# EAGLE design ST link V2 (EAGLE 6.1)
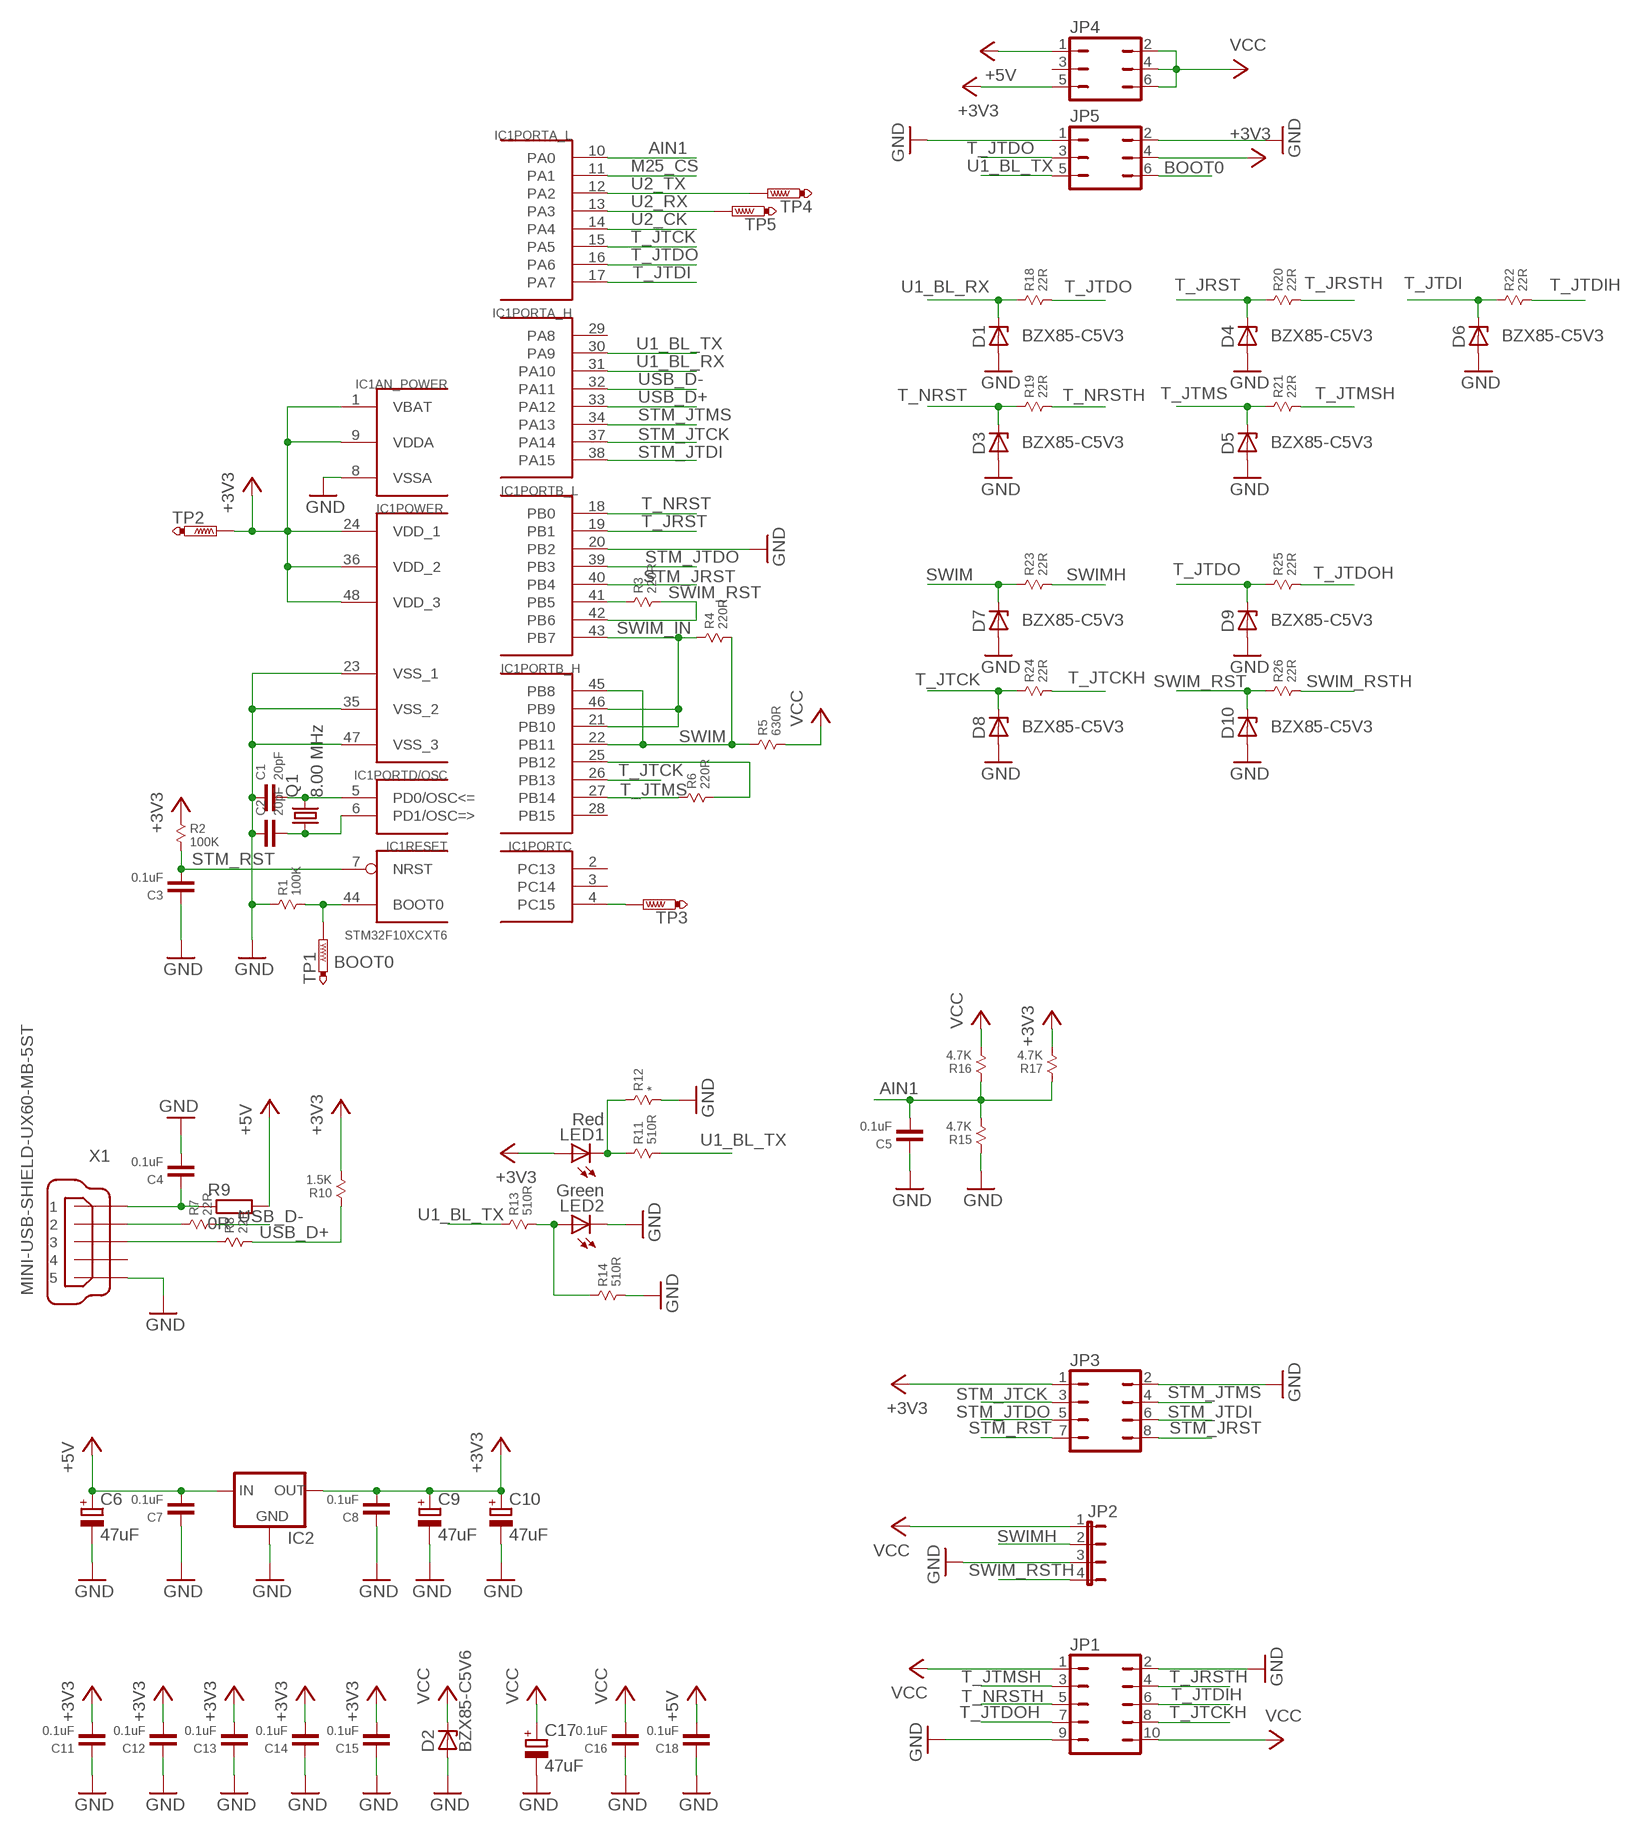
[diagram p0: schematic, sheet 1]

## Parts
C1  20pF  X893_CAP-0805  [X893_0805]
C2  20pF  X893_CAP-0805  [X893_0805]
C3  0.1uF  X893_CAP-0805  [X893_0805]
C4  0.1uF  X893_CAP-0805  [X893_0805]
C5  0.1uF  X893_CAP-0805  [X893_0805]
C6  47uF  CPOL-EUSMCB  [SMC_B]
C7  0.1uF  X893_CAP-0805  [X893_0805]
C8  0.1uF  X893_CAP-0805  [X893_0805]
C9  47uF  CPOL-EUSMCB  [SMC_B]
C10  47uF  CPOL-EUSMCB  [SMC_B]
C11  0.1uF  X893_CAP-0805  [X893_0805]
C12  0.1uF  X893_CAP-0805  [X893_0805]
C13  0.1uF  X893_CAP-0805  [X893_0805]
C14  0.1uF  X893_CAP-0805  [X893_0805]
C15  0.1uF  X893_CAP-0805  [X893_0805]
C16  0.1uF  X893_CAP-0805  [X893_0805]
C17  47uF  CPOL-EUSMCB  [SMC_B]
C18  0.1uF  X893_CAP-0805  [X893_0805]
D1  BZX85-C5V3  ZENER-DIODESOD80C  [SOD80C]
D2  BZX85-C5V6  ZENER-DIODESOD80C  [SOD80C]
D3  BZX85-C5V3  ZENER-DIODESOD80C  [SOD80C]
D4  BZX85-C5V3  ZENER-DIODESOD80C  [SOD80C]
D5  BZX85-C5V3  ZENER-DIODESOD80C  [SOD80C]
D6  BZX85-C5V3  ZENER-DIODESOD80C  [SOD80C]
D7  BZX85-C5V3  ZENER-DIODESOD80C  [SOD80C]
D8  BZX85-C5V3  ZENER-DIODESOD80C  [SOD80C]
D9  BZX85-C5V3  ZENER-DIODESOD80C  [SOD80C]
D10  BZX85-C5V3  ZENER-DIODESOD80C  [SOD80C]
IC1  STM32F10XCXT6  [TQFP48]
IC2  LM1117  [SOT223]
JP1  JP5Q  [JP5Q]
JP2  JP4E  [JP4]
JP3  JP4Q  [JP4Q]
JP4  JP3Q  [JP3Q]
JP5  JP3Q  [JP3Q]
LED1  Red  LEDSML0805  [SML0805]
LED2  Green  LEDSML0805  [SML0805]
Q1  8.00 MHz  CRYSTALHC49U70  [HC49U70]
R1  100K  X893_RESISTOR-0805  [X893_0805]
R2  100K  X893_RESISTOR-0805  [X893_0805]
R3  220R  X893_RESISTOR-0805  [X893_0805]
R4  220R  X893_RESISTOR-0805  [X893_0805]
R5  630R  X893_RESISTOR-0805  [X893_0805]
R6  220R  X893_RESISTOR-0805  [X893_0805]
R7  22R  X893_RESISTOR-0805  [X893_0805]
R8  22R  X893_RESISTOR-0805  [X893_0805]
R9  0R  R-EU_R1206  [R1206]
R10  1.5K  X893_RESISTOR-0805  [X893_0805]
R11  510R  X893_RESISTOR-0805  [X893_0805]
R12  *  X893_RESISTOR-0805  [X893_0805]
R13  510R  X893_RESISTOR-0805  [X893_0805]
R14  510R  X893_RESISTOR-0805  [X893_0805]
R15  4.7K  X893_RESISTOR-0805  [X893_0805]
R16  4.7K  X893_RESISTOR-0805  [X893_0805]
R17  4.7K  X893_RESISTOR-0805  [X893_0805]
R18  22R  X893_RESISTOR-0805  [X893_0805]
R19  22R  X893_RESISTOR-0805  [X893_0805]
R20  22R  X893_RESISTOR-0805  [X893_0805]
R21  22R  X893_RESISTOR-0805  [X893_0805]
R22  22R  X893_RESISTOR-0805  [X893_0805]
R23  22R  X893_RESISTOR-0805  [X893_0805]
R24  22R  X893_RESISTOR-0805  [X893_0805]
R25  22R  X893_RESISTOR-0805  [X893_0805]
R26  22R  X893_RESISTOR-0805  [X893_0805]
TP1  PTR1TP19R  [TP19R]
TP2  PTR1TP19R  [TP19R]
TP3  PTR1TP19R  [TP19R]
TP4  PTR1TP19R  [TP19R]
TP5  PTR1TP19R  [TP19R]
X1  MINI-USB-SHIELD-UX60-MB-5ST  [UX60-MB-5ST]

## Nets
+3V3: C8.1 C9.+ C10.+ C11.1 C12.1 C13.1 C14.1 C15.1 IC1.1(AN_POWER:VBAT) IC1.9(AN_POWER:VDDA) IC1.24(POWER:VDD_1) IC1.36(POWER:VDD_2) IC1.48(POWER:VDD_3) IC2.2(OUT) JP3.1 JP4.5 JP5.4 LED1.A R2.1 R10.2 R17.2 TP2.TP
+5V: C6.+ C7.1 C18.1 IC2.3(IN) JP4.1 R9.2
AIN1: C5.1 IC1.10(PORTA_L:PA0) R15.2 R16.1 R17.1
BOOT0: IC1.44(RESET:BOOT0) JP5.6 R1.2 TP1.TP
GND: C1.2 C2.2 C3.2 C4.1 C5.2 C6.- C7.2 C8.2 C9.- C10.- C11.2 C12.2 C13.2 C14.2 C15.2 C16.2 C17.- C18.2 D1.A D2.A D3.A D4.A D5.A D6.A D7.A D8.A D9.A D10.A IC1.8(AN_POWER:VSSA) IC1.20(PORTB_L:PB2) IC1.23(POWER:VSS_1) IC1.35(POWER:VSS_2) IC1.47(POWER:VSS_3) IC2.1(GND) JP1.2 JP1.9 JP2.3 JP3.2 JP5.1 JP5.2 LED2.C R1.1 R12.2 R14.2 R15.1 X1.5
M25_CS: IC1.11(PORTA_L:PA1)
N$1: C1.1 IC1.5(PORTD/OSC:PD0/OSC<=) Q1.2
N$2: C2.1 IC1.6(PORTD/OSC:PD1/OSC=>) Q1.1
N$3: IC1.4(PORTC:PC15) TP3.TP
N$4: C4.2 R9.1 X1.1
N$5: IC1.25(PORTB_H:PB12) R6.2
N$6: R7.1 X1.2
N$7: R8.1 X1.3
N$8: LED1.C R11.1 R12.1
N$9: IC1.41(PORTB_L:PB5) R3.1
N$10: LED2.A R13.2 R14.1
STM_JRST: IC1.40(PORTB_L:PB4) JP3.8
STM_JTCK: IC1.37(PORTA_H:PA14) JP3.3
STM_JTDI: IC1.38(PORTA_H:PA15) JP3.6
STM_JTDO: IC1.39(PORTB_L:PB3) JP3.5
STM_JTMS: IC1.34(PORTA_H:PA13) JP3.4
STM_RST: C3.1 IC1.7(RESET:NRST) JP3.7 R2.2
SWIM: D7.C IC1.22(PORTB_H:PB11) IC1.45(PORTB_H:PB8) R4.2 R5.1 R23.1
SWIM_IN: IC1.21(PORTB_H:PB10) IC1.43(PORTB_L:PB7) IC1.46(PORTB_H:PB9) R4.1
SWIM_RST: D10.C IC1.42(PORTB_L:PB6) R3.2 R26.1
SWIM_RSTH: JP2.4 R26.2
SWIMH: JP2.2 R23.2
T_JRST: D4.C IC1.19(PORTB_L:PB1) R20.1
T_JRSTH: JP1.4 R20.2
T_JTCK: D8.C IC1.15(PORTA_L:PA5) IC1.26(PORTB_H:PB13) R24.1
T_JTCKH: JP1.8 R24.2
T_JTDI: D6.C IC1.17(PORTA_L:PA7) R22.1
T_JTDIH: JP1.6 R22.2
T_JTDO: D9.C IC1.16(PORTA_L:PA6) JP5.3 R18.2 R25.1
T_JTDOH: JP1.7 R25.2
T_JTMS: D5.C IC1.27(PORTB_H:PB14) R6.1 R21.1
T_JTMSH: JP1.3 R21.2
T_NRST: D3.C IC1.18(PORTB_L:PB0) R19.1
T_NRSTH: JP1.5 R19.2
U1_BL_RX: D1.C IC1.31(PORTA_H:PA10) R18.1
U1_BL_TX: IC1.30(PORTA_H:PA9) JP5.5 R11.2 R13.1
U2_CK: IC1.14(PORTA_L:PA4)
U2_RX: IC1.13(PORTA_L:PA3) TP5.TP
U2_TX: IC1.12(PORTA_L:PA2) TP4.TP
USB_D+: IC1.33(PORTA_H:PA12) R8.2 R10.1
USB_D-: IC1.32(PORTA_H:PA11) R7.2
VCC: C16.1 C17.+ D2.C JP1.1 JP1.10 JP2.1 JP4.2 JP4.4 JP4.6 R5.2 R16.2
Unconnected: IC1.2(PORTC:PC13) IC1.3(PORTC:PC14) IC1.28(PORTB_H:PB15) IC1.29(PORTA_H:PA8) JP4.3 X1.4 X1.M1(S1) X1.M2(S2) X1.M3(S3) X1.M4(S4)

## Library data of the parts
C1-C5 C7 C8 C11-C16 C18 = maple-10x-20x:X893_CAP: Capacitor
C6 C9 C10 C17 = resistor:CPOL-EU: POLARIZED CAPACITOR, European symbol
D1-D10 = diode:ZENER-DIODE: Z-Diode
IC1 = stm32:STM32F10XCXT6: ST STM32F101/103 48pin LQFP
IC2 = v-reg-3:LM1117
JP1 = jumper:JP5Q: JUMPER
JP2 = jumper:JP4E: JUMPER
JP3 = jumper:JP4Q: JUMPER
JP4 JP5 = jumper:JP3Q: JUMPER
LED1 LED2 = led:LED: LED OSRAM: - CHIPLED LG R971, LG N971, LY N971, LG Q971, LY Q971, LO R971, LY R971 LH N974, LH R974 LS Q976, LO Q976, LY Q976 LO Q996 - Hyper CHIPLED LW Q18S LB Q993, LB Q99A, LB R99A - SideLED LS A670, LO A670, LY A670, LG A670, LP A670 LB A673, LV A673, LT A673, LW A673 LH A674 LY A675 LS A676, LA A676, LO A676, LY A676, LW A676 LS A679, LY A679, LG A679 - Hyper Micro SIDELED® LS Y876, LA Y876, LO Y876, LY Y876 LT Y87S - SmartLED LW L88C, LW L88S LB L89C, LB L89S, LG L890 LS L89K, LO L89K, LY L89K LS L896, LA L896, LO L896, LY L896 - TOPLED LS T670, LO T670, LY T670, LG T670, LP T670 LSG T670, LSP T670, LSY T670, LOP T670, LYG T670 LG T671, LOG T671, LSG T671 LB T673, LV T673, LT T673, LW T673 LH T674 LS T676, LA T676, LO T676, LY T676, LB T676, LH T676, LSB T676, LW T676 LB T67C, LV T67C, LT T67C, LS T67K, LO T67K, LY T67K, LW E67C LS E67B, LA E67B, LO E67B, LY E67B, LB E67C, LV E67C, LT E67C LW T67C LS T679, LY T679, LG T679 LS T770, LO T770, LY T770, LG T770, LP T770 LB T773, LV T773, LT T773, LW T773 LH T774 LS E675, LA E675, LY E675, LS T675 LS T776, LA T776, LO T776, LY T776, LB T776 LHGB T686 LT T68C, LB T68C - Hyper Mini TOPLED® LB M676 - Mini TOPLED Santana® LG M470 LS M47K, LO M47K, LY M47K Source: http://www.osram.convergy.de LUXEON: - LUMILED® LXK2-PW12-R00, LXK2-PW12-S00, LXK2-PW14-U00, LXK2-PW14-V00 LXK2-PM12-R00, LXK2-PM12-S00, LXK2-PM14-U00 LXK2-PE12-Q00, LXK2-PE12-R00, LXK2-PE12-S00, LXK2-PE14-T00, LXK2-PE14-U00 LXK2-PB12-K00, LXK2-PB12-L00, LXK2-PB12-M00, LXK2-PB14-N00, LXK2-PB14-P00, LXK2-PB14-Q00 LXK2-PR12-L00, LXK2-PR12-M00, LXK2-PR14-Q00, LXK2-PR14-R00 LXK2-PD12-Q00, LXK2-PD12-R00, LXK2-PD12-S00 LXK2-PH12-R00, LXK2-PH12-S00 LXK2-PL12-P00, LXK2-PL12-Q00, LXK2-PL12-R00 Source: www.luxeon.com KINGBRIGHT: KA-3528ASYC Source: www.kingbright.com
Q1 = crystal:CRYSTAL: CRYSTAL; OC_FARNELL: unknown; OC_NEWARK: unknown
R1-R8 R10-R26 = maple-10x-20x:X893_RESISTOR
R9 = rcl:R-EU_: RESISTOR, European symbol
TP1-TP5 = testpad:PTR1: TEST PIN
X1 = con-hirose:MINI-USB-SHIELD-: MINI USB Connector Source: http://www.hirose.co.jp/cataloge_hp/e24000019.pdf; OC_FARNELL: unknown; OC_NEWARK: unknown

## Board
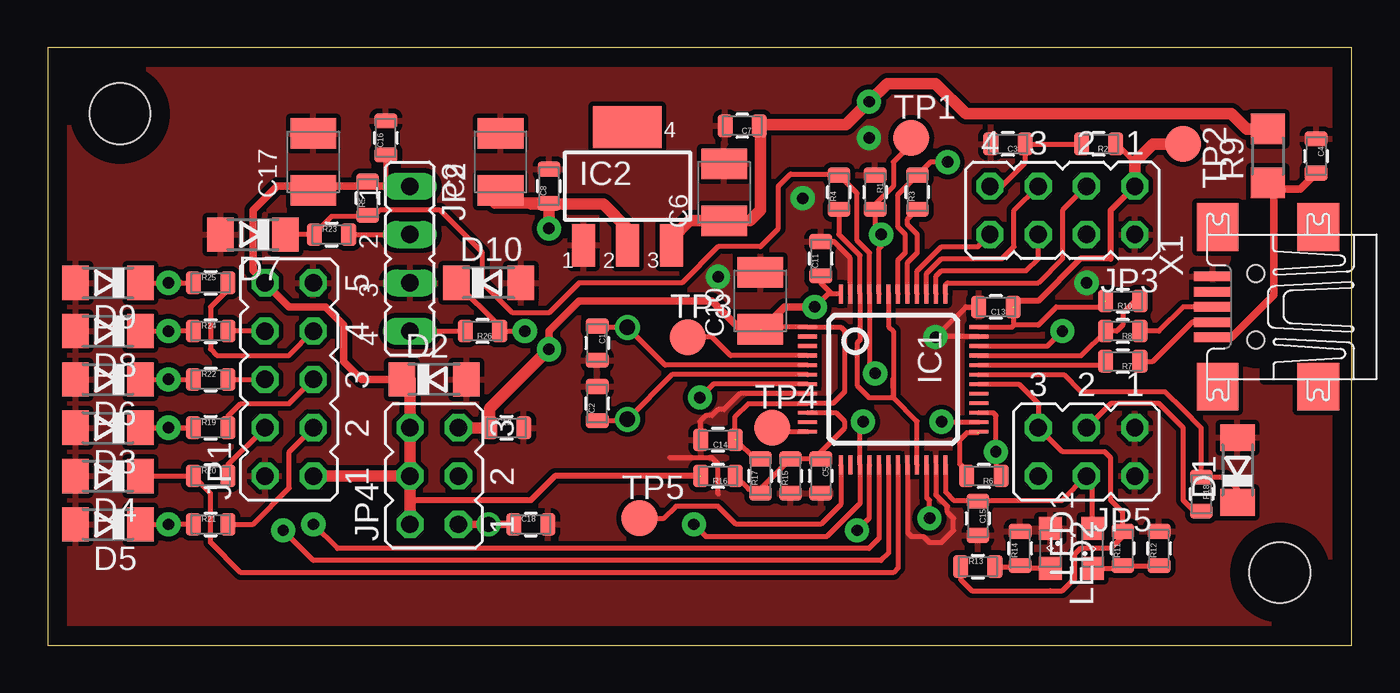
[diagram p1: board, top side]
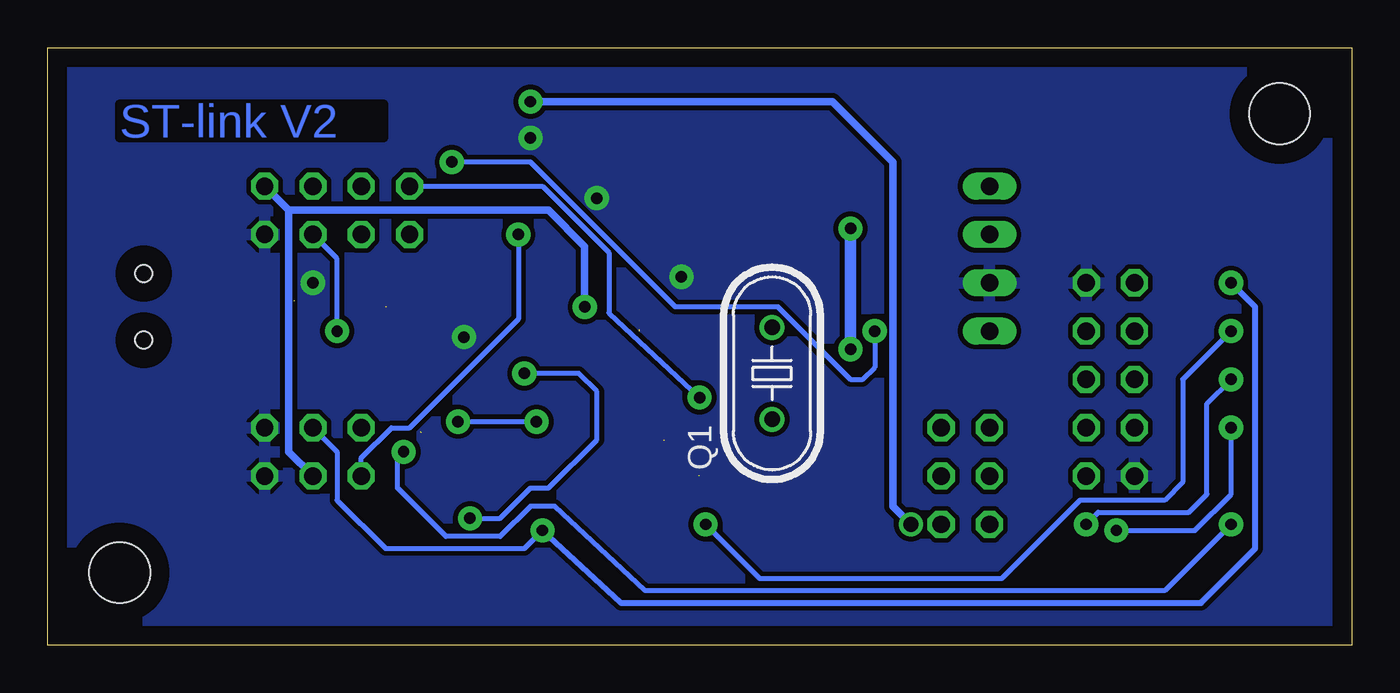
[diagram p2: board, bottom side, seen from below]

Size 68.56 x 31.42 mm. Coordinates in mm from the lower left corner, seen from the top.
Outline: 0,0 68.56,0 68.56,31.42 0,31.42 0,0
Copper layers (1*16): Top 0.035mm / dielectric 1.5mm / Bottom 0.035mm
Design rules: minimum track width 10mil, minimum drill 24mil, track to track 8mil, track to pad 8mil, pad to pad 8mil, via to via 8mil, smd to smd 8mil, copper to edge 40mil, drill to drill 8mil, minimum pad ring 10mil, minimum via ring 8mil, stop-mask expansion 4mil, vias tented up to drill 0mil, thermal gap 10mil
Holes 3.2 mm at 3.81,27.94 64.77,3.81

### Footprints (pad centres in the part's own frame; a part is rotated, then mirrored left to right if it is on the bottom)
X893_0805 = smd 0.8 x 1.2: 1 -0.9,0; 2 0.9,0
SMC_B = smd 1.6 x 2.4: + -1.5,0; - 1.5,0
SOD80C = smd 1.4 x 1.8: A 1.7,0; C -1.7,0
TQFP48 = smd 0.2 x 1: 1 -2.75,-4.5; 2 -2.25,-4.5; 3 -1.75,-4.5; 4 -1.25,-4.5; 5 -0.75,-4.5; 6 -0.25,-4.5; 7 0.25,-4.5; 8 0.75,-4.5; 9 1.25,-4.5; 10 1.75,-4.5; 11 2.25,-4.5; 12 2.75,-4.5; 25 2.75,4.5; 26 2.25,4.5; 27 1.75,4.5; 28 1.25,4.5; 29 0.75,4.5; 30 0.25,4.5; 31 -0.25,4.5; 32 -0.75,4.5; 33 -1.25,4.5; 34 -1.75,4.5; 35 -2.25,4.5; 36 -2.75,4.5 | smd 1 x 0.2: 13 4.5,-2.75; 14 4.5,-2.25; 15 4.5,-1.75; 16 4.5,-1.25; 17 4.5,-0.75; 18 4.5,-0.25; 19 4.5,0.25; 20 4.5,0.75; 21 4.5,1.25; 22 4.5,1.75; 23 4.5,2.25; 24 4.5,2.75; 37 -4.5,2.75; 38 -4.5,2.25; 39 -4.5,1.75; 40 -4.5,1.25; 41 -4.5,0.75; 42 -4.5,0.25; 43 -4.5,-0.25; 44 -4.5,-0.75; 45 -4.5,-1.25; 46 -4.5,-1.75; 47 -4.5,-2.25; 48 -4.5,-2.75
SOT223 = smd 1.219 x 2.235: 1 -2.311,-3.099; 2 0,-3.099; 3 2.311,-3.099 | smd 3.6 x 2.2: 4 0,3.099
JP5Q = drill 0.914 octagon: 1 -5.08,-1.27; 2 -5.08,1.27; 3 -2.54,-1.27; 4 -2.54,1.27; 5 0,-1.27; 6 0,1.27; 7 2.54,-1.27; 8 2.54,1.27; 9 5.08,-1.27; 10 5.08,1.27
JP4 = drill 0.914 long: 1 -3.81,0; 2 -1.27,0; 3 1.27,0; 4 3.81,0
JP4Q = drill 0.914 octagon: 1 -3.81,-1.27; 2 -3.81,1.27; 3 -1.27,-1.27; 4 -1.27,1.27; 5 1.27,-1.27; 6 1.27,1.27; 7 3.81,-1.27; 8 3.81,1.27
JP3Q = drill 0.914 octagon: 1 -2.54,-1.27; 2 -2.54,1.27; 3 0,-1.27; 4 0,1.27; 5 2.54,-1.27; 6 2.54,1.27
SML0805 = smd 1.2 x 1.2: A 1.05,0; C -1.05,0
HC49U70 = drill 0.813: 1 -2.413,0; 2 2.413,0
R1206 = smd 1.6 x 1.803: 1 -1.422,0; 2 1.422,0
TP19R = smd 1.9 x 1.9: TP 0,0
UX60-MB-5ST = smd 2 x 0.5: 1 2.25,1.6; 2 2.25,0.8; 3 2.25,0; 4 2.25,-0.8; 5 2.25,-1.6 | smd 2.2 x 2.5: M1 -3.3,-4.2; M2 -3.3,4.2; M3 2,4.2; M4 2,-4.2 | hole 0.9: 0,-1.75; 0,1.75

### Placement (x,y rotation side)
C1  28.89,15.88 270 top
C2  28.89,12.7 90 top
C3  50.48,26.35 180 top
C4  66.67,25.72 270 top
C5  40.64,8.89 270 top
C6  35.56,23.81 90 top
C7  36.51,27.3 180 top
C8  26.35,24.13 90 top
C9  23.81,25.4 90 top
C10  37.47,18.1 90 top
C11  40.64,20.32 90 top
C12  24.13,11.43 0 top
C13  49.85,17.78 180 top
C14  35.24,10.79 180 top
C15  48.9,6.67 270 top
C16  17.78,26.67 90 top
C17  13.97,25.4 90 top
C18  25.4,6.35 0 top
D1  62.55,9.21 90 top
D2  20.32,13.97 0 top
D3  3.17,11.43 180 top
D4  3.17,8.89 180 top
D5  3.17,6.35 180 top
D6  3.17,13.97 180 top
D7  10.79,21.59 180 top
D8  3.17,16.51 180 top
D9  3.17,19.05 180 top
D10  23.18,19.05 0 top
IC1  44.45,13.97 270 top
IC2  30.48,24.13 0 top
JP1  12.7,13.97 90 top
JP2  19.05,20.32 270 top
JP3  53.34,22.86 180 top
JP4  20.32,8.89 90 top
JP5  54.61,10.16 180 top
LED1  54.93,5.08 90 top
LED2  52.7,5.08 270 top
Q1  30.48,14.29 90 bottom
R1  43.5,23.81 270 top
R2  55.24,26.35 180 top
R3  45.72,23.81 90 top
R4  41.59,23.81 90 top
R5  16.83,23.5 90 top
R6  49.21,8.89 180 top
R7  56.52,14.92 180 top
R8  56.52,16.51 180 top
R9  64.14,25.72 90 top
R10  56.52,18.1 180 top
R11  56.52,5.08 90 top
R12  58.42,5.08 90 top
R13  48.9,4.13 0 top
R14  51.12,5.08 90 top
R15  39.05,8.89 90 top
R16  35.24,8.89 180 top
R17  37.47,8.89 90 top
R18  60.64,7.94 270 top
R19  8.57,11.43 0 top
R20  8.57,8.89 0 top
R21  8.57,6.35 0 top
R22  8.57,13.97 0 top
R23  14.92,21.59 0 top
R24  8.57,16.51 0 top
R25  8.57,19.05 0 top
R26  22.86,16.51 180 top
TP1  45.4,26.67 0 top
TP2  59.69,26.35 270 top
TP3  33.66,16.19 0 top
TP4  38.1,11.43 0 top
TP5  31.11,6.67 0 top
X1  63.5,17.78 180 top

### Tracks (layer width: path | path; a pad name or v marks a point on that pad's centre or on a via)
+3V3  (via drill 0.6 pad 1.27)  (4 unrouted)
  Top 0.254: LED1.A 54.93,8.57 JP5.4 53.34,7.62 48.95,7.62 | IC1.48 41.22,18.47 | 41.22,18.47 40.64,19.05 C11.1 | 41.22,18.47 41.01,18.47 v40.32,17.78 | IC1.24 47.2,8.04 47.62,7.62 48.95,7.62 | 48.95,7.62 C15.1 | 36.2,10.79 37.2,9.79 R17.2 | C14.1 36.14,12.01 36.83,12.7 39.93,12.7 IC1.9 41.3,12.72 41.91,13.34 41.91,16.51 41.7,16.72 IC1.1 37.04,16.72 36.92,16.6 | C10.+ 36.92,16.6 | 36.92,16.6 36.83,16.51 | R2.1 56.2,26.35 57.15,25.4 | IC1.36 50.69,16.72 50.8,16.83 | 50.8,16.83 50.8,17.78 | 50.8,16.83 52.07,16.83 53.02,17.78 55.24,17.78 55.56,18.1
  Top 0.305: JP3.1 55.88,22.86 55.88,20.32 54.29,20.32 52.07,18.1 51.12,18.1 50.8,17.78
  Top 0.406: C10.+ 36.42,16.6 34.92,18.1 27.94,18.1 26.35,16.51 v26.35,15.56 | v40.32,17.78 38.73,17.78 37.47,16.51
  Top 0.61: JP3.1 57.15,25.4 58.1,26.35 TP2.TP | 26.35,23.18 25.45,23.18 C8.1 23.53,23.23 C9.+ | IC2.2 30.48,21.91 29.21,23.18 26.35,23.18 | 26.35,23.18 v26.35,21.91 | JP4.5 C12.1 23.23,12.44 v26.35,15.56
  Bottom 0.406: v40.32,17.78 40.32,20.95 42.23,22.86 55.88,22.86 | 55.88,22.86 JP3.1 | JP5.4 55.88,10.16 55.88,22.86
  Bottom 0.61: v26.35,21.91 v26.35,15.56
+5V  (via drill 0.6 pad 1.27, 0.8 pad 1.27)
  Top 0.406: JP4.1 v23.18,6.35 C18.1
  Top 0.61: R9.2 63.03,27.14 62.23,27.94 48.26,27.94 46.67,29.53 44.13,29.53 v43.18,28.57 41.96,27.36 37.47,27.36 C7.1 37.47,27.25 37.47,22.86 36.92,22.31 C6.+ 33.74,22.31 32.79,21.36 IC2.3
  Bottom 0.406: v43.18,28.57 27.3,28.57 24.13,25.4 24.13,7.3 v23.18,6.35
AIN1
  Top 0.254: IC1.10 41.44,12.22 41.59,12.06 41.91,11.75 41.91,11.43 40.64,10.16 C5.1 39.32,9.79 39.05,9.53 R15.2 37.47,8.2 | 37.47,8.2 R17.1 37.47,8.2 | 37.47,8.2 36.83,8.2 R16.1
BOOT0  (via drill 0.6 pad 1.27)
  Top 0.254: IC1.44 43.7,20.84 43.81,20.95 v43.81,21.59 43.5,21.91 R1.2 43.5,23.18 44.45,24.13 44.45,25.4 45.4,26.35 TP1.TP
  Bottom 0.254: JP5.6 52.07,9.84 50.48,11.43 49.53,11.43 43.81,17.14 v43.81,21.59
GND  (via drill 0.6 pad 1.27)
  Top 0.254: IC1.47 42.2,20.35 41.33,21.22 C11.2 | 35.24,7.94 35.24,9.53 34.92,9.84 32.7,9.84 | IC1.35 47.28,16.22 46.99,16.51 48.26,17.78 C13.2 | IC1.20 45.2,5.92 45.4,5.71 46.04,5.71 46.35,5.4 46.99,5.4 47.62,6.03 47.62,6.67 47.31,6.99 47.31,7.3 46.67,7.94 46.7,7.96 IC1.23 | IC1.8 36.4,13.22 35.56,12.38 35.24,12.38 34.92,12.06 34.61,12.06 34.29,11.75 34.29,10.85 C14.2
  other vias: 35.24,19.37 43.18,26.67 39.69,23.5 54.61,19.05 46.67,16.19
  pour Top (isolate 0.254): 74.93,-10.16 74.93,43.18 -8.89,43.18 -8.89,-5.08 -8.89,-10.16
  pour Bottom (isolate 0.254): -5.08,45.72 -5.08,-6.35 72.39,-6.35 72.39,45.72
N$1
  Top 0.254: IC1.5 32.46,14.72 Q1.2 28.97,16.7 C1.1
N$2
  Top 0.254: IC1.6 32.83,14.22 Q1.1 30.41,11.8 C2.1
N$3
  Top 0.254: IC1.4 35.9,15.22 34.92,16.19 TP3.TP
N$4
  Top 0.406: X1.1 62.22,16.18 62.87,16.83 64.45,18.41 64.45,23.98 | 64.45,23.98 R9.1 | 64.45,23.98 65.83,23.98 C4.2
N$5  (1 unrouted)
  Top 0.254: 48.9,11.16 48.31,11.16 48.26,11.11 47.94,10.79 47.94,10.48 47.94,9.53 48.26,9.21 R6.2
N$6
  Top 0.254: X1.2 60.16,16.98 58.42,15.24 58.1,14.92 R7.1
N$7
  Top 0.254: X1.3 59.69,17.78 58.42,16.51 R8.1 | R8.1 57.15,16.51 R8.1
N$8
  Top 0.254: 55.3,3.66 LED1.C 56.37,4.03 R11.1 R12.1
N$9
  Top 0.254: R3.1 45.2,22.39 45.2,22.11 45.72,21.59 45.72,20.64 45.4,20.32 45.2,20.12 IC1.41
N$10
  Top 0.254: 52.44,3.77 LED2.A 51.27,4.03 R14.1 51.06,4.13 R13.2
STM_JRST
  Top 0.254: IC1.40 45.7,19.66 46.99,20.95 48.9,20.95 JP3.8
STM_JTCK
  Top 0.254: JP3.3 53.34,22.86 53.34,20.32 52.07,19.05 47.31,19.05 47.2,18.94 IC1.37
STM_JTDI
  Top 0.254: IC1.38 46.7,19.39 46.99,19.68 51.44,19.68 52.07,20.32 JP3.6
STM_JTDO
  Top 0.254: IC1.39 46.2,19.53 46.99,20.32 50.16,20.32 50.8,20.95 50.8,22.86 JP3.5
STM_JTMS  (via drill 0.6 pad 1.27)
  Top 0.254: IC1.34 52.55,15.72 v53.34,16.51
  Bottom 0.254: v53.34,16.51 53.34,20.32 JP3.4
STM_RST  (via drill 0.6 pad 1.27)
  Top 0.254: IC1.7 34.99,13.72 v34.29,13.02 | R2.2 C3.1 51.38,25.35 50.16,24.13 JP3.7
  Bottom 0.254: JP3.7 42.55,24.13 39.05,20.64 39.05,17.46 v34.29,13.02
SWIM  (via drill 0.6 pad 1.27)
  Top 0.254: R4.2 42.55,23.76 42.55,21.27 43.2,20.62 IC1.45 43.2,14.59 v43.5,14.29 | v46.35,6.67 46.35,7.62 46.2,7.78 46.2,8.1 IC1.22 | 13.97,21.59 R23.1 14.02,21.64 | 13.97,21.59 D7.C | R4.2 41.22,24.71 | 16.88,22.54 14.92,22.54 13.97,21.59 | 16.88,22.54 17.14,22.54 17.46,22.86 20.64,22.86 22.86,20.64 22.86,19.05 24.45,17.46 26.35,17.46 27.94,19.05 33.34,19.05 35.24,20.95 37.47,20.95 38.42,21.91 38.42,24.13 39.05,24.77 41.54,24.77 R4.2 | 16.88,22.54 R5.1
  Bottom 0.254: v46.35,6.67 44.77,6.67 43.18,8.26 42.23,8.26 39.69,10.79 39.69,13.34 40.64,14.29 v43.5,14.29
SWIM_IN
  Top 0.254: R4.1 41.59,21.59 42.7,20.48 IC1.46 42.7,16.03 42.55,15.88 42.55,13.65 43.18,13.02 44.45,13.02 | 44.45,13.02 44.43,13.99 | IC1.43 44.2,16.76 44.45,16.51 44.45,13.02 | IC1.21 45.7,11.77 44.45,13.02
SWIM_RST  (via drill 0.6 pad 1.27)
  Top 0.254: D10.C 23.76,16.77 R26.1 v25.08,16.51 | v47.31,25.4 46.41,25.4 R3.2 44.7,23.69 44.7,21.98 45.09,21.59 45.09,20.64 44.7,20.25 IC1.42
  Bottom 0.254: v47.31,25.4 43.18,25.4 35.56,17.78 30.16,17.78 26.35,13.97 25.72,13.97 25.08,14.61 v25.08,16.51
SWIM_RSTH
  Top 0.254: JP2.4 R26.2
SWIMH
  Top 0.254: R23.2 JP2.2
T_JRST
  Top 0.254: D4.C R20.1 8.57,7.99 8.57,5.4 10.16,3.81 44.45,3.81 44.7,4.06 IC1.19
T_JRSTH
  Top 0.254: R20.2 9.47,9.47 JP1.4
T_JTCK  (via drill 0.6 pad 1.27)
  Top 0.254: IC1.26 47.02,11.72 v46.99,11.75 | D8.C v6.35,16.51 R24.1 | v33.97,6.35 34.61,5.71 40.96,5.71 42.7,7.46 IC1.15 42.7,11.59 v42.86,11.75
  Bottom 0.254: v46.99,11.75 v42.86,11.75 | v6.35,16.51 8.89,13.97 8.89,8.57 9.84,7.62 14.29,7.62 18.41,3.49 31.11,3.49 v33.97,6.35
T_JTCKH
  Top 0.254: JP1.8 R24.2
T_JTDI  (via drill 0.6 pad 1.27)
  Top 0.254: D6.C v6.35,13.97 | v6.35,13.97 7.62,13.97 | 7.62,13.97 R22.1 | IC1.17 43.7,5.6 43.18,5.08 15.24,5.08 v13.97,6.35 | v6.35,13.97 7.62,13.97
  Bottom 0.254: v13.97,6.35 13.34,6.99 8.57,6.99 7.62,7.94 7.62,12.7 v6.35,13.97
T_JTDIH
  Top 0.254: R22.2 JP1.6
T_JTDO  (via drill 0.6 pad 1.27)
  Top 0.254: 54.88,11.7 JP5.3 55.88,12.7 58.42,12.7 59.69,11.43 59.69,7.62 60.27,7.04 R18.2 | IC1.16 43.18,9.45 43.18,6.67 v42.55,6.03 | D9.C v6.35,19.05 | 6.99,19.05 R25.1
  Top 0.305: v6.35,19.05 6.99,19.05
  Bottom 0.254: JP5.3 53.34,10.16 53.34,7.62 50.8,5.08 43.5,5.08 v42.55,6.03
  Bottom 0.305: v6.35,19.05 5.08,17.78 5.08,5.08 7.94,2.22 38.42,2.22 v42.55,6.03
T_JTDOH
  Top 0.254: R25.2 9.47,18.68 8.57,17.78 8.57,15.56 8.89,15.24 12.7,15.24 JP1.7
T_JTMS  (via drill 0.6 pad 1.27)
  Top 0.254: IC1.27 49.69,12.22 49.85,12.06 v49.85,10.16 49.85,9.47 R6.1 | D5.C v6.35,6.35 R21.1
  Bottom 0.254: v6.35,6.35 9.84,2.86 37.15,2.86 41.91,7.3 43.18,7.3 44.77,5.71 47.62,5.71 50.16,8.26 50.16,9.84 v49.85,10.16
T_JTMSH
  Top 0.254: R21.2 10.79,6.35 12.7,8.26 12.7,10.16 JP1.3
T_NRST  (via drill 0.6 pad 1.27)
  Top 0.254: D3.C 5.08,11.43 | 5.08,11.43 v6.35,11.43 | v6.35,11.43 R19.1 v6.35,11.43 | v6.35,11.43 5.08,11.43 | IC1.18 44.2,4.83 43.81,4.45 13.97,4.45 v12.38,6.03 | v6.35,11.43 5.08,11.43
  Bottom 0.254: v12.38,6.03 11.75,6.03 8.26,6.03 6.35,7.94 v6.35,11.43
T_NRSTH
  Top 0.254: R19.2 9.47,12.01 10.16,12.7 12.7,12.7 JP1.5
U1_BL_RX
  Top 0.254: IC1.31 52.45,14.22 53.41,14.22 54.29,13.34 57.41,13.34 58.74,13.34 59.69,12.38 60.64,11.43 R18.1 61.91,8.84 62.55,8.2 D1.C
U1_BL_TX
  Top 0.254: IC1.30 51.05,13.72 52.07,12.7 JP5.5 53.34,10.16 55.56,10.16 55.88,9.84 55.88,7.62 56.52,6.99 R11.2 56.52,5.71 55.88,5.08 54.29,5.08 53.98,4.76 53.98,3.49 53.34,2.86 52.7,2.86 48.58,2.86 47.99,3.44 R13.1
U2_RX
  Top 0.254: IC1.13 41.7,7.41 40.64,6.35 36.2,6.35 35.24,7.3 33.02,7.3 32.38,6.67 TP5.TP
U2_TX
  Top 0.254: IC1.12 38.31,11.22 TP4.TP
USB_D+
  Top 0.254: IC1.33 54.33,15.22 R8.2 56.2,16.51 56.52,16.83 56.52,17.46 57.15,18.1 R10.1
USB_D-
  Top 0.254: IC1.32 55.41,14.72 R7.2
VCC  (1 unrouted)
  Top 0.254: 20.32,24.13 JP2.1 | C16.1 17.78,24.13 17.09,24.13 R5.2 | C17.+ 12.93,23.9 12.7,24.13
  Top 0.305: 34.29,8.89 26.67,8.89 25.4,7.62 19.05,7.62
  Top 0.406: JP2.1 17.78,24.13 12.7,24.13 12.06,24.13 10.79,22.86 10.79,19.68 JP1.10 12.7,17.78 14.61,17.78 15.56,16.83 15.56,14.92 16.51,13.97 18.73,13.97
  Top 0.61: JP4.2 19.05,7.62 JP4.4 | JP4.4 JP4.6 19.05,13.97 18.73,13.97 D2.C | JP4.4 JP1.1

### Text on the board
Bottom: ST-link V2